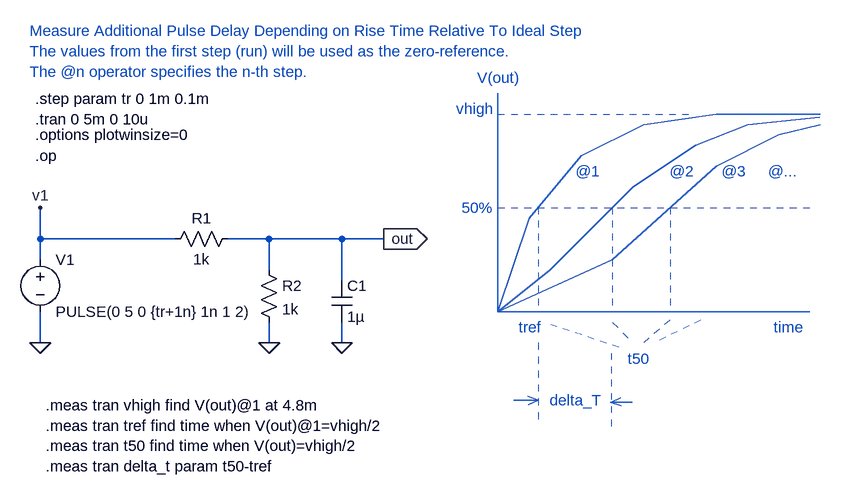
[diagram p0: schematic RC_meas_at_step.asc]
RC_meas_at_step.asc, the LTspice schematic file:
Version 4
SHEET 1 1476 680
WIRE -336 144 -336 96
WIRE -128 144 -336 144
WIRE 16 144 -48 144
WIRE 128 144 16 144
WIRE 192 144 128 144
WIRE -336 176 -336 144
WIRE 16 192 16 144
WIRE 128 208 128 144
WIRE -336 304 -336 256
WIRE 16 304 16 272
WIRE 128 304 128 272
FLAG -336 304 0
FLAG -336 96 v1
FLAG 16 304 0
FLAG 128 304 0
FLAG 192 144 out
IOPIN 192 144 Out
SYMBOL voltage -336 160 R0
WINDOW 123 0 0 Left 0
WINDOW 39 0 0 Left 0
SYMATTR InstName V1
SYMATTR Value PULSE(0 5 0 {tr+1n} 1n 1 2)
SYMBOL res -144 160 R270
WINDOW 0 32 56 VTop 0
WINDOW 3 0 56 VBottom 0
SYMATTR InstName R1
SYMATTR Value 1k
SYMBOL res 0 176 R0
SYMATTR InstName R2
SYMATTR Value 1k
SYMBOL cap 112 208 R0
SYMATTR InstName C1
SYMATTR Value 1µ
TEXT -344 -72 Left 0 !.step param tr 0 1m 0.1m
TEXT -344 16 Left 0 !.op
TEXT -344 -40 Left 0 !.tran 0 5m 0 10u
TEXT -344 -16 Left 0 !.options plotwinsize=0
TEXT -328 400 Left 0 !.meas tran vhigh find V(out)@1 at 4.8m\n.meas tran tref find time when V(out)@1=vhigh/2\n.meas tran t50 find time when V(out)=vhigh/2\n.meas tran delta_t param t50-tref
TEXT -352 -176 Left 0 ;Measure Additional Pulse Delay Depending on Rise Time Relative To Ideal Step\nThe values from the first step (run) will be used as the zero-reference.\nThe @n operator specifies the n-th step.
TEXT 304 -56 Left 0 ;vhigh
TEXT 312 96 Left 0 ;50%
TEXT 400 280 Left 0 ;tref
TEXT 568 328 Left 0 ;t50
TEXT 448 392 Left 0 ;delta_T
TEXT 488 40 Left 0 ;@1
TEXT 632 40 Left 0 ;@2
TEXT 712 40 Left 0 ;@3
TEXT 784 40 Left 0 ;@...
TEXT 792 280 Left 0 ;time
TEXT 336 -104 Left 0 ;V(out)
LINE Normal 368 256 368 -80
LINE Normal 848 256 368 256
LINE Normal 416 112 368 256
LINE Normal 496 16 416 112
LINE Normal 592 -32 496 16
LINE Normal 704 -48 592 -32
LINE Normal 864 -48 704 -48
LINE Normal 448 192 368 256
LINE Normal 576 64 448 192
LINE Normal 672 0 576 64
LINE Normal 752 -32 672 0
LINE Normal 863 -43 752 -32
LINE Normal 544 176 368 256
LINE Normal 704 32 544 176
LINE Normal 800 -16 704 32
LINE Normal 864 -32 800 -16
LINE Normal 368 -48 672 -48 2
LINE Normal 368 96 848 96 2
LINE Normal 544 96 544 256 2
LINE Normal 430 96 430 256 2
LINE Normal 633 96 633 256 2
LINE Normal 544 272 576 304 2
LINE Normal 632 269 592 304 2
LINE Normal 449 275 554 310 2
LINE Normal 680 269 608 304 2
LINE Normal 430 304 430 432 2
LINE Normal 542 320 542 432 2
LINE Normal 543 395 575 395
LINE Normal 392 392 431 392
LINE Normal 414 386 431 392
LINE Normal 415 399 430 392
LINE Normal 558 401 541 395
LINE Normal 557 388 542 395

The netlist it stands for:
* RC_meas_at_step.asc
V1 v1 0 PULSE(0 5 0 {tr+1n} 1n 1 2)
R1 v1 out 1k
R2 out 0 1k
C1 out 0 1µ
.step param tr 0 1m 0.1m
.op
.tran 0 5m 0 10u
.options plotwinsize=0
.meas tran vhigh find V(out)@1 at 4.8m
.meas tran tref find time when V(out)@1=vhigh/2
.meas tran t50 find time when V(out)=vhigh/2
.meas tran delta_t param t50-tref
* Measure Additional Pulse Delay Depending on Rise Time Relative To Ideal Step
* The values from the first step (run) will be used as the zero-reference.
* The @n operator specifies the n-th step.
* vhigh
* 50%
* tref
* t50
* delta_T
* @1
* @2
* @3
* @...
* time
* V(out)
.backanno
.end